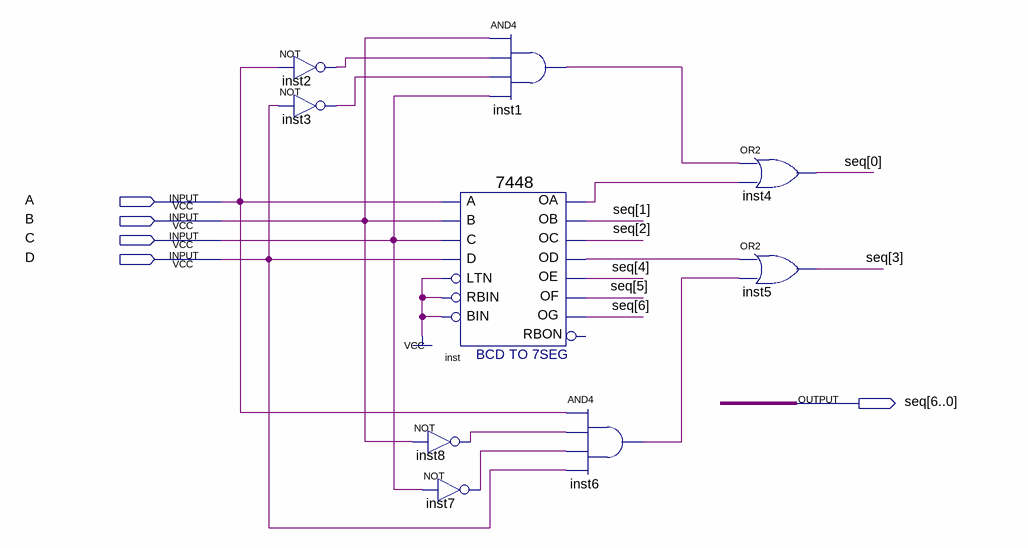
[diagram p0: schematic sheet]
// Quartus schematic lab2.bdf as structural Verilog: 9 symbols, 5 pins
module lab2 (
  input  A,
  input  B,
  input  C,
  input  D,
  output [6:0] seq
);

  wire inst1_out, inst2_out, inst3_out, inst6_out, inst7_out, inst8_out, inst_oa, inst_od;

  not inst2 (inst2_out, A);
  not inst3 (inst3_out, D);
  \7448  inst (
    .A(A), .C(C), .D(D), .B(B), .RBIN(1'b1), .BIN(1'b1), .LTN(1'b1), .OC(seq[2]), .OE(seq[4]), .OD(inst_od),
    .OF(seq[5]), .OG(seq[6]), .OB(seq[1]), .OA(inst_oa));  // open: RBON
  not inst8 (inst8_out, B);
  not inst7 (inst7_out, C);
  and inst1 (inst1_out, B, inst2_out, inst3_out, C);
  and inst6 (inst6_out, A, inst8_out, inst7_out, D);
  or inst4 (seq[0], inst1_out, inst_oa);
  or inst5 (seq[3], inst_od, inst6_out);
endmodule
